# EasyEDA Pro project New Project_2025-03-25_15-12-27.eprj, board PCB1
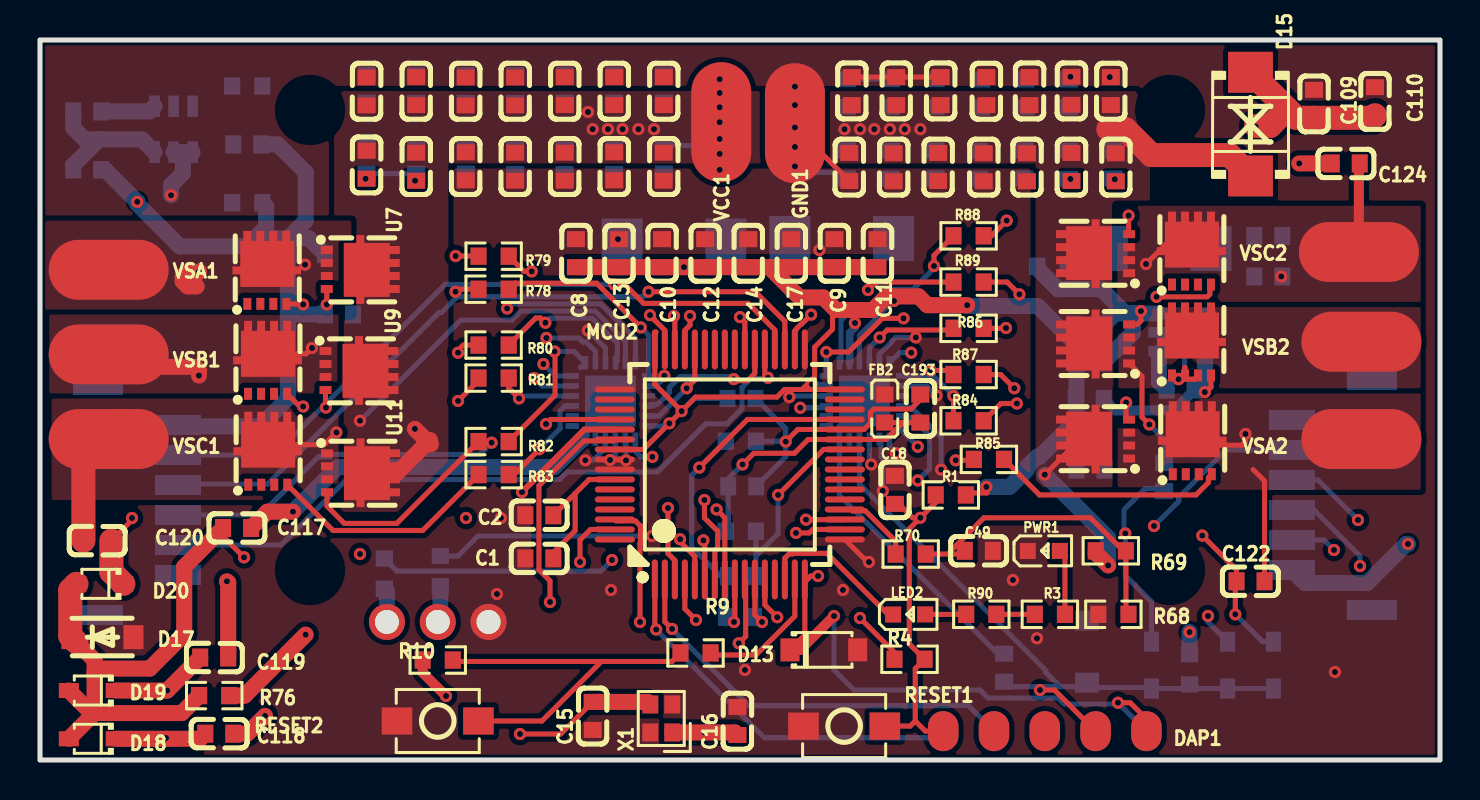
[diagram p4: board, top side]
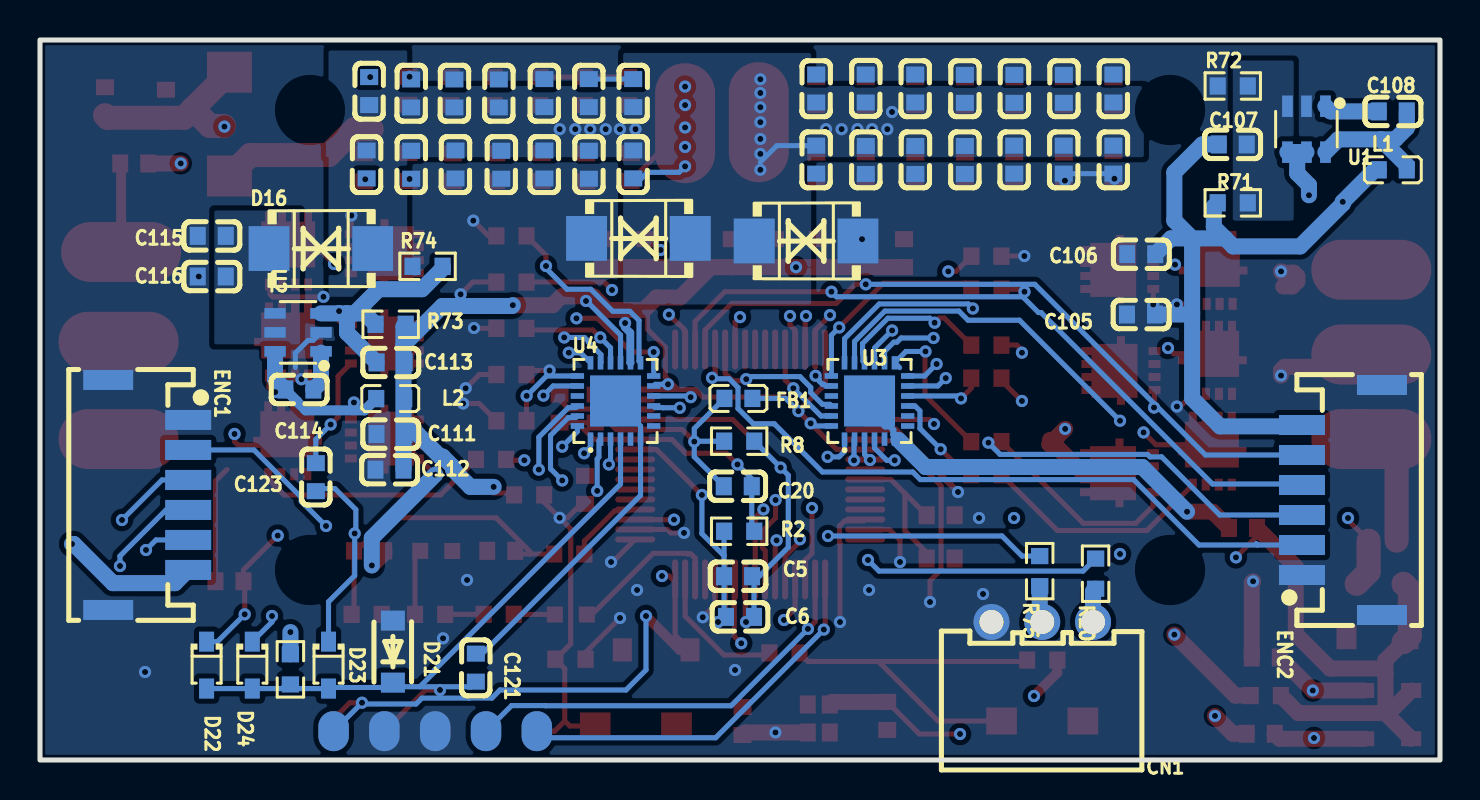
[diagram p5: board, bottom side, seen from below]

Outline 70 x 36 mm; copper layers: Top Layer, Inner1, Inner2, Inner3, Inner4, Bottom Layer. Coordinates in mm from the lower left corner of the outline.
Outline path: rectangle 0,36 70,0
Stack: Top Layer 0.035mm 外层铜厚1oz / Dielectric1 0.0994mm 3313 RC57% 4.2mil / Inner1 0.0152mm 内层铜厚 / Dielectric2 0.55mm 0.55mm H/H No copper / Inner2 0.0152mm 内层铜厚 / Dielectric3 0.1088mm 2116 RC54% 4.9mil / Inner3 0.0152mm 内层铜厚 / Dielectric4 0.55mm 0.55mm H/H No copper / Inner4 0.0152mm 内层铜厚 / Dielectric5 0.0994mm 3313 RC57% 4.2mil / Bottom Layer 0.035mm 外层铜厚1oz

## Design rules (mm)
template: 自定义配置
spacing copperThickness1oz (default): track to track 0.102, other pairs 0.152 to 0.3
spacing copperThickness2oz: track to track 0.203, other pairs 0.152 to 0.3
track width copperThickness1oz (default): min 0.127, default 0.254, max 2.54
track width copperThickness2oz: min 0.203, default 0.254, max 2.54
differential pair differentialPair (default): width min 0.127, default 0.254, max 2.54; gap min 0.152, default 0.152
via viaSize (default): diameter min 0.5, default 0.61, max 10; hole min 0.3, default 0.305, max 6.3

## Placement (name value [footprint] x y rotation side)
C1  4.7uF  [C0603]  24.97 10.08 0 top
C2  100nF  [C0603]  24.97 12.24 0 top
C5  2.5uf  [C0603]  35.1 9.19 180 bottom
C6  100nF  [C0603]  35 7.16 180 bottom
C8  4.7uF  [C0603]  26.8 25.34 90 top
C9  4.7uF  [C0603]  39.72 25.34 90 top
C10  100nF  [C0603]  31.1 25.34 90 top
C11  100nF  [C0603]  41.87 25.34 90 top
C12  4.7uF  [C0603]  33.26 25.34 90 top
C13  100nF  [C0603]  28.95 25.34 90 top
C14  4.7uF  [C0603]  35.41 25.34 90 top
C15  10pF  [C0603]  27.63 2.2 90 top
C16  10pF  [C0603]  34.87 1.95 90 top
C17  100nF  [C0603]  37.57 25.34 90 top
C18  100nF  [C0603]  42.75 13.51 90 top
C19  22nF  [C0603]  21.28 33.43 270 top
C20  100nF  [C0603]  35.11 13.69 180 bottom
C49  100nF  [C0603]  46.94 10.46 0 top
C50  22nF  [C0603]  16.33 33.43 270 top
C51  22nF  [C0603]  23.76 33.43 270 top
C52  22nF  [C0603]  16.33 29.76 90 top
C53  22nF  [C0603]  21.29 29.68 90 top
C54  22nF  [C0603]  40.59 33.45 270 top
C55  22nF  [C0603]  28.71 29.68 90 top
C56  22nF  [C0603]  42.81 33.45 270 top
C57  22nF  [C0603]  45.03 33.45 270 top
C58  22nF  [C0603]  49.47 33.45 270 top
C59  22nF  [C0603]  40.47 29.65 90 top
C60  22nF  [C0603]  31.19 30.02 90 bottom
C61  22nF  [C0603]  21.29 30.02 90 bottom
C62  22nF  [C0603]  18.81 30.02 90 bottom
C63  22nF  [C0603]  16.33 30.02 90 bottom
C64  22nF  [C0603]  51.57 29.65 90 top
C65  22nF  [C0603]  44.91 29.65 90 top
C66  22nF  [C0603]  18.81 33.56 270 bottom
C67  22nF  [C0603]  21.28 33.56 270 bottom
C68  22nF  [C0603]  23.76 33.56 270 bottom
C69  22nF  [C0603]  28.71 33.57 270 bottom
C70  22nF  [C0603]  51.44 33.33 270 bottom
C71  22nF  [C0603]  47.06 33.33 270 bottom
C72  22nF  [C0603]  49.28 33.33 270 bottom
C73  22nF  [C0603]  40.34 29.78 90 bottom
C74  22nF  [C0603]  53.67 29.78 90 bottom
C75  22nF  [C0603]  44.78 29.78 90 bottom
C76  22nF  [C0603]  49.23 29.78 90 bottom
C77  22nF  [C0603]  18.81 33.45 90 top
C78  22nF  [C0603]  28.71 33.45 90 top
C79  22nF  [C0603]  26.24 33.45 90 top
C80  22nF  [C0603]  31.19 33.45 90 top
C81  22nF  [C0603]  18.81 29.67 270 top
C82  22nF  [C0603]  31.18 29.67 270 top
C83  22nF  [C0603]  26.23 29.67 270 top
C84  22nF  [C0603]  23.76 29.67 270 top
C85  22nF  [C0603]  47.32 33.45 90 top
C86  22nF  [C0603]  51.57 33.46 90 top
C87  22nF  [C0603]  53.54 33.45 90 top
C88  22nF  [C0603]  28.71 30 270 bottom
C89  22nF  [C0603]  26.23 30 270 bottom
C90  22nF  [C0603]  23.76 30 270 bottom
C91  22nF  [C0603]  53.79 29.64 270 top
C92  22nF  [C0603]  49.35 29.64 270 top
C93  22nF  [C0603]  47.19 29.64 270 top
C94  22nF  [C0603]  42.68 29.64 270 top
C95  22nF  [C0603]  16.33 33.57 90 bottom
C96  22nF  [C0603]  26.24 33.57 90 bottom
C97  22nF  [C0603]  31.19 33.57 90 bottom
C98  22nF  [C0603]  40.34 33.34 90 bottom
C99  22nF  [C0603]  42.56 33.34 90 bottom
C100  22nF  [C0603]  44.78 33.34 90 bottom
C101  22nF  [C0603]  53.54 33.45 90 bottom
C102  22nF  [C0603]  42.56 29.76 270 bottom
C103  22nF  [C0603]  46.94 29.76 270 bottom
C104  22nF  [C0603]  51.44 29.76 270 bottom
C105  22nF  [C0603]  14.95 22.28 0 bottom
C106  100nF  [C0603]  14.94 25.29 0 bottom
C107  220pF  [C0603]  10.36 30.78 180 bottom
C108  100nF  [C0603]  2.36 32.43 0 bottom
C109  22nF  [C0603]  63.7 32.81 90 top
C110  100nF  [C0603]  66.75 32.94 90 top
C111  22nF  [C0603]  52.47 16.3 0 bottom
C112  100nF  [C0603]  52.53 14.52 0 bottom
C113  220pF  [C0603]  52.47 19.88 0 bottom
C114  100nF  [C0603]  57.03 18.52 180 bottom
C115  22nF  [C0603]  61.42 26.21 0 bottom
C116  100nF  [C0603]  61.42 24.17 0 bottom
C117  22nF  [C0603]  9.85 11.6 0 top
C118  4.7uF  [C0603]  8.97 1.31 0 top
C119  4.7uF  [C0603]  8.71 5.12 180 top
C120  4.7uF  [C0603]  2.87 10.97 0 top
C121  22nF  [C0603]  48.21 4.62 90 bottom
C122  4.7uF  [C0603]  60.53 8.94 0 top
C123  4.7uF  [C0603]  56.21 14.14 270 bottom
C124  4.7uF  [C0603]  65.29 29.83 180 top
C193  4.7uF  [C0603]  44.02 17.57 270 top
CN1  XH-3AW  [CONN-TH_3P-P2.54_HCTL_XH-3AW]  19.89 6.9 0 bottom
D5  SMBJ12CA  [SMB_L4.6-W3.6-LS5.4-BI]  40.08 26.08 180 bottom
D13  SMF3.3A  [SOD-123_L2.8-W1.8-LS3.7-RD]  39.19 5.51 0 top
D14  SMBJ12CA  [SMB_L4.6-W3.6-LS5.4-BI]  31.7 25.95 180 bottom
D15  SMBJ12CA  [SMB_L4.6-W3.6-LS5.4-BI]  60.53 31.8 270 top
D16  SMBJ12CA  [SMB_L4.6-W3.6-LS5.4-BI]  55.96 25.57 180 bottom
D17  BZT52C15-7-F  [SOD-123F_L2.8-W1.8-LS3.7-RD]  3.12 6.14 0 top
D18  B5819WS-TP  [SOD-323_L1.8-W1.3-LS2.5-RD]  2.61 1.06 180 top
D19  B5819WS-TP  [SOD-323_L1.8-W1.3-LS2.5-RD]  2.61 3.47 180 top
D20  B5819WS-TP  [SOD-323_L1.8-W1.3-LS2.5-RD]  3 8.81 180 top
D21  BZT52C15-7-F  [SOD-123F_L2.8-W1.8-LS3.7-RD]  52.35 5.42 90 bottom
D22  B5819WS-TP  [SOD-323_L1.8-W1.3-LS2.5-RD]  61.67 4.74 270 bottom
D23  B5819WS-TP  [SOD-323_L1.8-W1.3-LS2.5-RD]  55.57 4.74 270 bottom
D24  B5819WS-TP  [SOD-323_L1.8-W1.3-LS2.5-RD]  59.38 4.74 270 bottom
DAP1  SWD  [2X5 2.54MM双层贴片焊盘]  50.24 1.44 270 top
ENC1  ZX-ZH1.5-6PWT  [CONN-SMD_6P-P1.50_ZX-ZH1.5-6PWT]  64.59 13.25 270 bottom
ENC2  ZX-ZH1.5-6PWT  [CONN-SMD_6P-P1.50_ZX-ZH1.5-6PWT]  4.9 13 90 bottom
FB1  BLM18PG121SN1D  [L0603]  35.08 18.08 0 bottom
FB2  BLM18PG121SN1D  [L0603]  42.24 17.57 270 top
GND1  -  [焊盘]  37.75 31.84 90 top
L1  4.7uH  [L0603]  2.36 29.51 0 bottom
L2  4.7uH  [L0603]  52.49 18.07 180 bottom
LED2  -  [LED_0603]  43.51 7.28 0 top
MCU2  CYT2BL3CAAQ0AZEGST  [LQFP-64_L10.0-W10.0-P0.50-LS12.0-BL]  34.49 14.78 0 top
PWR1  -  [LED_0603]  50.24 10.46 0 top
R1  10kΩ  [R0603]  45.54 13.25 180 top
R2  0Ω  [R0603]  35.04 11.44 0 bottom
R3  4.7K  [R0603]  50.49 7.28 0 top
R4  100Ω  [R0603]  43.48 5.04 0 top
R8  0Ω  [R0603]  35.04 15.94 180 bottom
R9  100R  [R0603]  32.78 5.35 0 top
R10  4.7K  [R0603]  19.89 5 180 top
R20  100RΩ  [R0603]  17.22 9.32 90 bottom
R68  1K  [R0603]  53.67 7.28 180 top
R69  10K  [R0603]  53.54 10.46 0 top
R70  100R  [R0603]  43.53 10.3 0 top
R71  73.2kΩ  [R0603]  10.36 27.86 0 bottom
R72  10kΩ  [R0603]  10.36 33.7 180 bottom
R73  45.3kΩ  [R0603]  52.47 21.78 180 bottom
R74  10kΩ  [R0603]  50.62 24.68 180 bottom
R75  100RΩ  [R0603]  20.01 9.44 90 bottom
R76  100RΩ  [R0603]  8.71 3.22 180 top
R77  100RΩ  [R0603]  57.48 4.53 270 bottom
R78  4.7Ω  [R0603]  22.68 23.54 180 top
R79  4.7Ω  [R0603]  22.68 25.19 180 top
R80  4.7Ω  [R0603]  22.68 20.75 180 top
R81  4.7Ω  [R0603]  22.68 19.09 180 top
R82  4.7Ω  [R0603]  22.68 15.92 180 top
R83  4.7Ω  [R0603]  22.68 14.27 180 top
R84  4.7Ω  [R0603]  46.43 16.96 0 top
R85  4.7Ω  [R0603]  47.45 15.03 0 top
R86  4.7Ω  [R0603]  46.43 21.58 0 top
R87  4.7Ω  [R0603]  46.43 19.27 0 top
R88  4.7Ω  [R0603]  46.43 26.21 0 top
R89  4.7Ω  [R0603]  46.43 23.9 0 top
R90  4.7K  [R0603]  47.06 7.28 180 top
RESET1  -  [Key_SMD_3x4x2]  40.21 1.7 180 top
RESET2  -  [Key_SMD_3x4x2]  19.89 1.95 180 top
U1  RY9121E  [SOT-23-6_L2.9-W1.6-P0.95-LS2.8-BL]  6.68 31.54 0 bottom
U2  RY9121E  [SOT-23-6_L2.9-W1.6-P0.95-LS2.8-BL]  57.1 21.38 90 bottom
U3  FD6288Q  [QFN-24_L4.0-W4.0-P0.50-BL-EP2.6]  28.52 17.95 180 bottom
U4  FD6288Q  [QFN-24_L4.0-W4.0-P0.50-BL-EP2.6]  41.22 17.95 180 bottom
U7  TPN2R703NL,L1Q(M  [TSON-8_L3.1-W3.1-P0.65-LS3.3-BL-EP]  16.01 24.53 270 top
U8  TPN2R703NL,L1Q(M  [TSON-8_L3.1-W3.1-P0.65-LS3.3-BL-EP]  11.34 24.48 0 top
U9  TPN2R703NL,L1Q(M  [TSON-8_L3.1-W3.1-P0.65-LS3.3-BL-EP]  15.95 19.48 270 top
U10  TPN2R703NL,L1Q(M  [TSON-8_L3.1-W3.1-P0.65-LS3.3-BL-EP]  11.38 19.98 0 top
U11  TPN2R703NL,L1Q(M  [TSON-8_L3.1-W3.1-P0.65-LS3.3-BL-EP]  16.03 14.36 270 top
U12  TPN2R703NL,L1Q(M  [TSON-8_L3.1-W3.1-P0.65-LS3.3-BL-EP]  11.39 15.44 0 top
U13  TPN2R703NL,L1Q(M  [TSON-8_L3.1-W3.1-P0.65-LS3.3-BL-EP]  52.78 16.05 90 top
U14  TPN2R703NL,L1Q(M  [TSON-8_L3.1-W3.1-P0.65-LS3.3-BL-EP]  57.61 15.96 0 top
U15  TPN2R703NL,L1Q(M  [TSON-8_L3.1-W3.1-P0.65-LS3.3-BL-EP]  52.78 20.8 90 top
U16  TPN2R703NL,L1Q(M  [TSON-8_L3.1-W3.1-P0.65-LS3.3-BL-EP]  57.57 20.9 0 top
U17  TPN2R703NL,L1Q(M  [TSON-8_L3.1-W3.1-P0.65-LS3.3-BL-EP]  52.78 25.32 90 top
U18  TPN2R703NL,L1Q(M  [TSON-8_L3.1-W3.1-P0.65-LS3.3-BL-EP]  57.57 25.44 0 top
VCC1  -  [焊盘]  34.06 31.89 90 top
VSA1  -  [焊盘]  3.43 24.51 0 top
VSA2  -  [焊盘]  66.07 16.05 0 top
VSB1  -  [焊盘]  3.43 20.28 0 top
VSB2  -  [焊盘]  66.07 20.91 0 top
VSC1  -  [焊盘]  3.43 16.05 0 top
VSC2  -  [焊盘]  65.94 25.4 0 top
X1  16MHz  [CRYSTAL-SMD_4P-L2.0-W1.6-BL]  31.06 2.08 90 top

## Footprints (pads in the part's own frame, mm; a bottom-side part is the same pattern mirrored in y, then rotated)
2X5 2.54MM双层贴片焊盘
  oval 2x1.524 smd: 1(0,-5.08) 3(0,-2.54) 5(0,0) 7(0,2.54) 9(0,5.08)
  oval 2x1.524 smd far side: 2(0,-5.08) 4(0,-2.54) 6(0,0) 8(0,2.54) 10(0,5.08)
C0603
  rect 0.8x0.9 smd: 1(-0.7,0) 2(0.7,0)
CONN-SMD_6P-P1.50_ZX-ZH1.5-6PWT
  rect 1x2.3 smd: 1(-3.75,2) 2(-2.25,2) 3(-0.75,2) 4(0.75,2) 5(2.25,2) 6(3.75,2)
  rect 1x2.5 smd: 7(5.75,-2) 8(-5.75,-2)
CONN-TH_3P-P2.54_HCTL_XH-3AW
  round 1.8 hole 1.199: 1(-2.54,0) 2(0.002,0) 3(2.54,0)
CRYSTAL-SMD_4P-L2.0-W1.6-BL
  rect 0.9x0.8 smd: 1(-0.7,-0.55) 2(0.7,-0.55) 3(0.7,0.55) 4(-0.7,0.55)
Key_SMD_3x4x2
  rect 1.53x1.36 smd: 1(-2.035,0) 2(2.035,0)
L0603
  rect 0.8x0.864 smd: 1(-0.7,0) 2(0.7,0)
LED_0603
  rect 0.8x0.8 smd: 1(-0.851,-0.01) 2(0.75,-0.005)
LQFP-64_L10.0-W10.0-P0.50-LS12.0-BL
  oval 0.3x2 smd: 1(-3.75,-5.75) 2(-3.25,-5.75) 3(-2.75,-5.75) 4(-2.25,-5.75) 5(-1.75,-5.75) 6(-1.25,-5.75) 7(-0.75,-5.75) 8(-0.25,-5.75) 9(0.25,-5.75) 10(0.75,-5.75) 11(1.25,-5.75) 12(1.75,-5.75) 13(2.25,-5.75) 14(2.75,-5.75) 15(3.25,-5.75) 16(3.75,-5.75) 33(3.75,5.75) 34(3.25,5.75) 35(2.75,5.75) 36(2.25,5.75) 37(1.75,5.75) 38(1.25,5.75) 39(0.75,5.75) 40(0.25,5.75) 41(-0.25,5.75) 42(-0.75,5.75) 43(-1.25,5.75) 44(-1.75,5.75) 45(-2.25,5.75) 46(-2.75,5.75) 47(-3.25,5.75) 48(-3.75,5.75)
  oval 2x0.3 smd: 17(5.75,-3.75) 18(5.75,-3.25) 19(5.75,-2.75) 20(5.75,-2.25) 21(5.75,-1.75) 22(5.75,-1.25) 23(5.75,-0.75) 24(5.75,-0.25) 25(5.75,0.25) 26(5.75,0.75) 27(5.75,1.25) 28(5.75,1.75) 29(5.75,2.25) 30(5.75,2.75) 31(5.75,3.25) 32(5.75,3.75) 49(-5.75,3.75) 50(-5.75,3.25) 51(-5.75,2.75) 52(-5.75,2.25) 53(-5.75,1.75) 54(-5.75,1.25) 55(-5.75,0.75) 56(-5.75,0.25) 57(-5.75,-0.25) 58(-5.75,-0.75) 59(-5.75,-1.25) 60(-5.75,-1.75) 61(-5.75,-2.25) 62(-5.75,-2.75) 63(-5.75,-3.25) 64(-5.75,-3.75)
QFN-24_L4.0-W4.0-P0.50-BL-EP2.6
  rect 0.28x0.665 smd: 1(-1.25,-1.907) 2(-0.75,-1.907) 3(-0.25,-1.907) 4(0.25,-1.907) 5(0.75,-1.907) 6(1.25,-1.907) 13(1.25,1.907) 14(0.75,1.907) 15(0.25,1.907) 16(-0.25,1.907) 17(-0.75,1.907) 18(-1.25,1.907)
  rect 0.665x0.28 smd: 7(1.907,-1.25) 8(1.907,-0.75) 9(1.907,-0.25) 10(1.907,0.25) 11(1.907,0.75) 12(1.907,1.25) 19(-1.907,1.25) 20(-1.907,0.75) 21(-1.907,0.25) 22(-1.907,-0.25) 23(-1.907,-0.75) 24(-1.907,-1.25)
  rect 2.55x2.55 smd: 25(0,0)
R0603
  rect 0.806x0.864 smd: 1(-0.753,0) 2(0.753,0)
SMB_L4.6-W3.6-LS5.4-BI
  rect 2.047x2.241 smd: 1(-2.591,0) 2(2.591,0)
SOD-123_L2.8-W1.8-LS3.7-RD
  rect 0.95x1.15 smd: 1(-1.692,0) 2(1.692,0)
SOD-123F_L2.8-W1.8-LS3.7-RD
  rect 1x1.2 smd: 1(-1.55,0) 2(1.55,0)
SOD-323_L1.8-W1.3-LS2.5-RD
  rect 1x0.75 smd: 1(-1.173,0) 2(1.173,0)
SOT-23-6_L2.9-W1.6-P0.95-LS2.8-BL
  rect 0.532x1.072 smd: 1(-0.95,-1.149) 2(0,-1.149) 3(0.95,-1.149) 4(0.95,1.149) 5(0,1.149) 6(-0.95,1.149)
TSON-8_L3.1-W3.1-P0.65-LS3.3-BL-EP
  rect 0.4x0.6 smd: 1(-0.975,-1.675) 2(-0.325,-1.675) 3(0.325,-1.675) 4(0.975,-1.675) 5(0.975,1.675) 6(0.325,1.675) 7(-0.325,1.675) 8(-0.975,1.675)
  rect 0.6x0.4 smd: 9(-1.42,0) 9(1.42,0)
  rect 2.7x2.3 smd: 9(0.02,0.325)
焊盘
  oval 6x3 smd: 1(0,0)

## Nets
As in the schematic.

Pads without a net: DAP1 3 5; MCU2 13 21 22 23 24 25 30 31 40 41 42 43 50 51 59 60 61 64; U3 5 7 8 21; U4 5 7 8 21

## Via types
v1: diameter 0.61, hole 0.305, Top Layer to Bottom Layer, 185 vias

## Routing (per net, layer and track width the routed paths; a pad name or vN(x,y) marks a point on that pad's centre or on a via; arc(x,y) is an arc through that point)
+3.3V: length 1.9
  Top Layer w0.254: R90.1 R3.1
+5V: length 135.6
  Inner2 w0.8: v1(4.86,27.91) 5.67,28.72 5.67,28.73 12.25,35.3 66.7,35.3 69.3,32.7 69.3,11.7 v1(68.4,10.8)
  Bottom Layer w0.8: 10.74,26.08 11.31,26.65 11.31,27.66 R71.2 ; 10.74,26.08 10.34,25.68 6.99,25.68 4.86,27.81 v1(4.86,27.91) 3.26,29.51 L1.2 ; 10.74,26.08 12.39,26.08 ; C107.1 11.89,30.78 13.28,29.38 13.28,26.97 12.39,26.08 ; 12.39,26.08 12.39,22.32 ; 12.39,26.08 13.45,26.08 C106.1 ; 12.39,22.32 12.44,22.28 C105.1 ; 12.39,22.32 12.39,18.08 11,16.68 6.97,16.68 ENC2.6 ; v1(68.4,10.8) 68.31,10.8 66.35,8.84 63.25,8.84 ENC1.6
GND: length 24.1
  Top Layer w0.254: U16.1 U16.2 57.25,19.61 57.23,19.63 ; GND1.1 37.75,31.67 C59.1 ; v1(56.93,19.04) 57.71,19.04 U16.3 ; C54.1 C56.1 C57.1 ; MCU2.17 41.37,9.9 v1(41.45,9.9)
  Inner1 w0.254: 57.4,35.3 57.8,34.9 57.9,34.9 ; 57.23,19.63 56.96,19.9 56.1,19.9
  Bottom Layer w0.254: v1(37.75,29.68) 38.05,29.38 39.64,29.38 39.94,29.08 C73.1 ; C63.1 C62.1 ; U2.2 56.35,20.98 56.6,20.98 57.23,20.34 57.23,19.63 ; C98.2 C99.2
  vias: v1(16.28,29.06) v1(18.75,28.97) v1(22.85,8.3) v1(23.05,12.1) v1(28.55,8.5) v1(28.9,26.04) v1(35.25,4.5) v1(37.75,33.67) v1(37.75,32.75) v1(37.75,31.63) v1(37.75,30.65) v1(38.97,25.5) v1(40.15,8.5) v1(48.65,9) v1(49.85,6.08) v1(51.52,34.16) v1(51.52,29.05) v1(53.49,34.15) v1(53.74,29.04) v1(62.06,24.17) v1(64.75,4.4)
VBAT: length 72.2
  Top Layer w0.254: v1(50.24,14.27) 52.04,16.07 U13.9
  Top Layer w0.8: 19.4,15.9 17.84,14.34 U11.9 ; 19.4,15.9 19.5,16 ; 19.4,15.9 v1(18.74,16.56) ; 19.4,15.9 19.51,15.79 19.54,15.79 ; R76.1 10.23,3.22 v1(13.28,6.27) ; v1(53.41,9.73) 52.79,10.35 R69.1
  Top Layer w1.2: 53.41,31.54 54.27,31.54 55.57,30.25 59.48,30.25 D15.2
  Inner1 w0.254: v1(29.92,31.54) 30.43,31.54
  Inner1 w0.8: v1(13.28,6.27) 18.74,11.73 18.74,16.19 ; v1(27.4,32.4) 22.5,27.5 22.5,17 21.69,16.19 18.74,16.19 ; 18.74,16.19 v1(18.74,16.56) ; v1(53.41,9.73) 53.41,9.69 55.65,7.45 55.69,7.45 56.74,6.39 v1(57.48,6.39)
  Bottom Layer w0.254: 33.98,29.89 33.16,30.72 C60.2
  Bottom Layer w0.8: v1(50.24,14.27) 53.41,11.1 v1(53.41,9.73) ; v1(57.48,6.39) R77.1
  vias: v1(27.63,31.54) v1(28.4,31.54) v1(29.13,31.54) v1(30.7,31.54) v1(33.98,34.04) v1(33.98,33.35) v1(33.98,32.64) v1(33.98,31.89) v1(33.98,31.05) v1(33.98,30.31) v1(33.98,29.51) v1(40.22,31.54) v1(41,31.54) v1(41.71,31.54) v1(42.49,31.54) v1(43.24,31.54) v1(44.02,31.54)
VCC1V1: length 7.5
  Top Layer w0.254: MCU2.58 27.46,14.03 26.76,13.33 ; C1.2 25.67,10.38 26.76,11.47 26.76,13.33 ; 26.76,13.33 C2.2
VCC3V3: length 139.6
  Top Layer w0.254: 39.63,22.67 39.63,21.54 38.73,20.64 38.73,19.16 38.1,18.53 ; 30.8,21.4 30.74,21.34 MCU2.48 30.74,18.78 v1(32.08,17.44) ; v1(32.08,17.44) 30.16,15.53 MCU2.55 ; v1(32.08,17.44) 32.78,18.15 36.85,18.15 37.23,18.53 38.1,18.53 ; R1.1 46.39,13.35 47.34,13.35 47.32,13.38 v1(47.32,13.66) ; 38.1,18.53 MCU2.32 ; v1(38.9,9.2) 38.54,9.2 38.37,9.03 MCU2.16 38.24,6.25 D13.1
  Top Layer w0.5: R10.2 19.13,4.37 v1(20.3,3.2) ; v1(39.7,7.2) 38.01,5.51 D13.1
  Top Layer w0.8: v1(46.36,22.74) 44.37,22.74 43.93,23.18 42.32,23.18 41.64,22.5 39.8,22.5 39.17,23.13 37.98,23.13 36.47,24.64 ; 36.47,24.64 C17.1 C9.1 C11.1 ; 36.47,24.64 C14.1 C12.1 v1(32.2,24.64) C10.1 C13.1 C8.1
  Inner1 w0.254: v1(47.32,13.66) 47.32,13.33 46.69,12.69 42.69,12.69 39.2,9.2 v1(38.9,9.2)
  Inner2 w0.5: v1(39.7,7.2) 33.05,0.55 22.95,0.55 v1(20.3,3.2)
  Bottom Layer w0.254: C111.1 50.84,16.3 48.2,13.66 ; DAP1.10 53.96,2.8 51.2,2.8 50.91,3.09 48.53,3.09 48.52,3.1 47.4,3.1 47,3.5 40.7,3.5 39.7,4.5 v1(39.7,7.2) ; FB1.1 32.71,18.08 v1(32.08,17.44)
  Bottom Layer w0.8: 51.83,20.76 49.88,22.7 46.4,22.7 v1(46.36,22.74) ; 51.83,20.76 51.83,21.68 R73.2 ; 51.83,20.76 51.83,17 ; C112.1 51.83,17 ; 51.83,17 51.12,16.3 50,15.17 49.87,15.17 49.34,14.64 49.34,14.51 48.48,13.66 v1(47.32,13.66)
VDDA: length 15.3
  Top Layer w0.254: v1(37.29,15.92) 37.89,16.53 MCU2.28 41.2,16.53 41.52,16.85 41.52,17.38 41.69,17.55 43.55,17.55 44.02,18.02 C193.1
  Bottom Layer w0.254: 37.29,15.94 37.29,16.57 FB1.2 ; 37.29,15.94 v1(37.29,15.92) 37.29,15.16 C20.1 ; 37.29,15.94 R8.1
VSSA: length 14.3
  Top Layer w0.254: C193.2 43.14,16.87 ; 43.14,16.87 FB2.2 ; 43.14,16.87 42.3,16.03 MCU2.27 38.41,16.03 37.72,15.34 35.69,15.34 v1(35.13,14.78)
  Bottom Layer w0.254: R2.1 34.41,11.56 C20.2 34.41,14.06 v1(35.13,14.78)
BATADC: length 3.8
  Top Layer w0.254: R70.1 42.78,10.94 41.27,12.46 40.62,12.46 40.55,12.53 MCU2.20
DBG_RX: length 19.3
  Top Layer w0.254: v1(30.81,6.52) 30.74,6.59 MCU2.1
  Bottom Layer w0.254: DAP1.2 44.83,1.11 36.22,1.11 v1(30.81,6.52)
DBG_TX: length 20.8
  Top Layer w0.254: MCU2.2 31.24,6.92 v1(31.6,6.55)
  Bottom Layer w0.254: DAP1.4 46.42,2.72 44.73,2.72 44.72,2.71 35.44,2.71 v1(31.6,6.55)
ECO_IN: length 26.8
  Top Layer w0.254: MCU2.52 25.53,17.03 v1(25.3,16.8) ; v1(24,1.3) 26.03,1.3 C15.2
  Top Layer w0.8: X1.3 30.39,2.9 C15.2
  Inner2 w0.254: v1(24,1.3) 24,15.5 v1(25.3,16.8)
ECO_OUT: length 25.1
  Top Layer w0.3: v1(24.1,13.4) 27.23,16.53 MCU2.53
  Top Layer w0.8: C16.1 34.75,1.38 v1(33.23,1.38) X1.1
  Inner1 w0.3: v1(33.23,1.38) 24.1,10.5 v1(24.1,13.4)
ENC1_CS: length 31.5
  Top Layer w0.254: MCU2.12 36.24,7.76 v1(36.86,7.14)
  Inner1 w0.254: v1(55.7,11.7) 55.53,11.53 42.13,11.53 37.74,7.14 v1(36.86,7.14)
  Bottom Layer w0.254: v1(55.7,11.7) 56.76,12.76 56.77,12.76 56.94,12.93 56.94,13.14 59.3,15.5 ENC1.2
ENC1_MISO: length 42.2
  Top Layer w0.254: MCU2.9 34.74,6.94 v1(34.7,6.9)
  Inner1 w0.254: v1(34.7,6.9) 37,4.6 59.7,4.6 65.9,10.8 v1(65.9,12)
  Bottom Layer w0.254: ENC1.3 63.9,14 v1(65.9,12)
ENC1_MOSI: length 42.2
  Top Layer w0.254: v1(34.94,5.84) 35.28,6.18 35.28,8.99 MCU2.10
  Inner1 w0.254: v1(66,9.7) 65.3,9.7 59.85,4.24 36.85,4.24 35.26,5.84 v1(34.94,5.84)
  Bottom Layer w0.254: v1(66,9.7) 66,10.2 63.7,12.5 ENC1.4
ENC1_SCLK: length 36.1
  Top Layer w0.254: v1(36.1,6.9) 35.74,7.26 MCU2.11
  Inner1 w0.254: v1(36.1,6.9) 36.27,6.9 37.97,5.2 59.4,5.2 v1(64.7,10.5)
  Bottom Layer w0.254: ENC1.5 64.2,11 v1(64.7,10.5)
ENC2_CS: length 35.2
  Top Layer w0.254: MCU2.37 36.24,19.27 v1(36.4,19.11)
  Bottom Layer w0.254: 9.11,10.75 12.05,10.75 15.32,14.02 25.98,14.02 26.36,14.4 30.87,14.4 33.28,16.81 34.34,16.81 35.1,17.57 35.1,18.63 35.53,19.06 36.35,19.06 v1(36.4,19.11) ; 9.11,10.75 9.19,10.82 ; 9.11,10.75 ENC2.2
ENC2_MISO: length 38.1
  Top Layer w0.254: v1(38.56,22.27) 38.09,21.81 38.06,21.81 37.81,21.55 37.81,21.53 37.74,21.46 MCU2.34
  Inner2 w0.254: v1(22.58,15.87) 24.19,17.48 24.19,17.5 25.3,18.6 25.3,18.98 26.3,19.98 34.87,19.98 37.16,22.27 v1(38.56,22.27)
  Bottom Layer w0.254: v1(22.58,15.87) 21.99,15.28 14.62,15.28 14.5,15.16 13.92,15.16 11.01,12.25 ENC2.3
ENC2_MOSI: length 36.4
  Top Layer w0.254: v1(30.43,23.41) 35.76,23.41 37.24,21.93 MCU2.35
  Bottom Layer w0.254: ENC2.4 6.95,13.8 11.37,13.8 19.95,22.37 20.07,22.37 20.86,23.16 30.17,23.16 v1(30.43,23.41)
ENC2_SCLK: length 35.3
  Top Layer w0.254: v1(28.71,23.78) 29.23,23.78 30.19,22.83 35.41,22.83 36.74,21.5 MCU2.36
  Bottom Layer w0.254: v1(28.71,23.78) 20.26,23.78 11.72,15.25 ENC2.5
HOA1: length 10.2
  Top Layer w0.254: R78.1 23.73,23.84 27.83,23.84 30.04,21.63 v1(30.04,21.63)
  Bottom Layer w0.254: U3.19 30.43,21.24 v1(30.04,21.63)
HOA2: length 4.2
  Top Layer w0.254: v1(45.67,18.21) 45.68,18.2 R84.1
  Bottom Layer w0.254: U4.19 44.67,19.2 v1(45.67,18.21)
HOB1: length 7.7
  Top Layer w0.254: v1(25.27,21.86) 25.03,22.1 24.79,22.1 R80.1
  Bottom Layer w0.254: U3.16 28.85,19.94 28.85,20.31 28.87,20.33 28.87,20.82 27.61,22.09 25.5,22.09 v1(25.27,21.86)
HOB2: length 5.4
  Top Layer w0.254: R86.1 45.59,21.5 42.36,21.5 v1(41.99,21.13)
  Bottom Layer w0.254: U4.16 41.47,20.61 v1(41.99,21.13)
HOC1: length 7.6
  Top Layer w0.254: v1(25.73,20.43) 25.75,20.4 25.75,18.24 R82.1
  Bottom Layer w0.254: v1(25.73,20.43) 26.71,20.43 U3.13 27.26,19.86 27.02,19.62
HOC2: length 9.9
  Top Layer w0.254: R88.1 44.7,25.23 v1(44.7,24.7)
  Bottom Layer w0.254: v1(44.7,24.7) 44.7,24.59 43.65,23.54 42.46,23.54 41.35,22.43 40.5,22.43 40.05,21.98 40.05,19.94 U4.13
KEY: length 6.9
  Top Layer w0.254: MCU2.15 37.74,7.19 35.8,5.25 33.63,5.25 R9.2
LED: length 7.8
  Top Layer w0.254: MCU2.14 37.24,10.1 37.45,10.31 37.64,10.31 37.67,10.33 39.35,10.33 42.4,7.27 LED2.1
LOA1: length 8.9
  Top Layer w0.254: v1(24.59,24.43) 24.2,24.43 R79.1
  Inner1 w0.254: v1(24.71,19.09) 24.59,19.22 v1(24.59,24.43)
  Bottom Layer w0.254: v1(24.71,19.09) 25.11,18.7 U3.11
LOA2: length 19.3
  Top Layer w0.254: v1(45.78,14.99) 46.65,14.99 R85.1
  Inner1 w0.254: 38.7,18.7 42.07,18.7 v1(45.78,14.99)
  Inner2 w0.254: v1(45.78,14.99) 45.78,15.42 42.41,18.79 v1(38.6,18.79)
  Bottom Layer w0.254: U4.11 39.23,18.78 38.87,18.78 38.86,18.79 v1(38.6,18.79)
LOB1: length 3.9
  Top Layer w0.254: R81.1 23.43,18.6 v1(23.95,18.08)
  Bottom Layer w0.254: v1(23.95,18.08) 24.07,18.2 U3.10
LOB2: length 10.8
  Top Layer w0.254: v1(44.53,19.48) 45.47,19.48 R87.1
  Inner1 w0.254: v1(44.53,19.48) 44.43,19.38 38.5,19.38 37.47,18.34 v1(37.47,18.14)
  Bottom Layer w0.254: U4.10 37.53,18.2 v1(37.47,18.14)
LOC1: length 5.1
  Top Layer w0.254: R83.1 23.7,14.27 v1(24.97,15.54)
  Bottom Layer w0.254: U3.9 26.25,17.7 26,17.46 26,16.58 v1(24.97,15.54)
LOC2: length 13.1
  Top Layer w0.254: v1(41.4,23.5) 41.8,23.9 R89.1
  Inner2 w0.254: v1(38.01,17.61) 38.01,17.86 38.05,17.9 38.05,18.39 38.01,18.42 38.01,20.11 v1(41.4,23.5)
  Bottom Layer w0.254: U4.9 39.23,17.62 38.87,17.62 38.86,17.61 v1(38.01,17.61)
PWM1AH: length 7.5
  Top Layer w0.254: v1(34.69,19.04) 34.76,18.97 35.38,18.97 35.74,19.33 MCU2.38
  Bottom Layer w0.254: U3.22 30.51,17.78 30.88,17.78 31.46,18.37 31.46,18.63 32,19.17 34.56,19.17 v1(34.69,19.04)
PWM1AL: length 12.1
  Top Layer w0.254: MCU2.39 35.24,21.9 v1(35,22.14)
  Inner1 w0.254: v1(35,22.14) 35,20.11 34.51,19.63 34.45,19.63 34.11,19.28 34.11,18.64 v1(30.62,15.16)
  Bottom Layer w0.254: v1(30.62,15.16) 30.05,15.16 29.77,15.43 U3.1
PWM1BH: length 4.6
  Top Layer w0.254: v1(32.33,18.59) 32.74,19 MCU2.44
  Bottom Layer w0.254: U3.23 30.95,17.2 v1(32.33,18.59)
PWM1BL: length 12.8
  Top Layer w0.254: MCU2.45 32.24,21.48 32.5,21.74 v1(32.5,22.2)
  Inner1 w0.254: v1(29.3,14.98) 29.3,20.06 31.12,21.88 31.12,22.44 31.46,22.78 31.94,22.78 32.28,22.44 32.28,22.42 v1(32.5,22.2)
  Bottom Layer w0.254: v1(29.3,14.98) 29.3,16.02 U3.2
PWM1CH: length 8.2
  Top Layer w0.254: v1(31.7,22.2) 31.74,22.16 MCU2.46
  Inner1 w0.254: v1(31.47,16.83) 31.5,16.86 31.5,17.69 31.7,17.89 v1(31.7,22.2)
  Bottom Layer w0.254: v1(31.47,16.83) 31.34,16.7 U3.24
PWM1CL: length 11.7
  Top Layer w0.254: MCU2.47 31.24,21.48 30.73,22 30.73,22.02 v1(30.5,22.25)
  Inner1 w0.254: v1(28.5,15) 28.5,21 29.75,22.25 v1(30.5,22.25)
  Bottom Layer w0.254: v1(28.5,15) 28.72,15.22 28.72,15.23 28.77,15.28 U3.3
PWM2AH: length 23.2
  Top Layer w0.254: MCU2.3 31.74,9.98 31.4,10.33 v1(31.4,12.6)
  Inner2 w0.254: v1(31.4,12.6) 32.73,12.6 33.59,11.74 37.17,11.74 38.03,12.6 40.46,12.6 42.56,14.7 44.88,14.7 v1(45.06,14.52)
  Bottom Layer w0.254: U4.22 43.21,17.62 43.58,17.62 45.06,16.14 v1(45.06,14.52)
PWM2AL: length 17.4
  Top Layer w0.254: MCU2.4 32.24,7.56 v1(32.8,7)
  Inner1 w0.254: v1(32.8,7) 35.64,9.84 37.12,9.84 38.88,11.61 38.88,13.08 41.14,15.34 v1(42.79,15.34)
  Bottom Layer w0.254: U4.1 42.47,15.66 v1(42.79,15.34)
PWM2BH: length 20.2
  Top Layer w0.254: MCU2.5 32.74,10.18 32,10.92 v1(32,11.04)
  Inner2 w0.254: v1(43.89,13.98) 40.31,10.4 32.93,10.4 32.29,11.04 v1(32,11.04)
  Bottom Layer w0.254: v1(43.89,13.98) 44.47,14.56 44.47,16.23 43.58,17.12 43.21,17.12 U4.23
PWM2BL: length 14.6
  Top Layer w0.254: v1(33.17,10.98) 33.24,10.91 MCU2.6
  Inner2 w0.254: v1(42.14,13.46) 39.67,10.98 v1(33.17,10.98)
  Bottom Layer w0.254: U4.2 42.05,15.96 42.05,15.15 42.14,15.06 v1(42.14,13.46)
PWM2CH: length 18.6
  Top Layer w0.254: v1(33.22,13) 33.22,12.11 33.88,11.45 33.88,10.61 33.74,10.47 MCU2.7
  Inner1 w0.254: v1(33.22,13) 33.22,13.89 35.25,15.92 36.46,15.92 37.04,15.34 37.53,15.34 38.11,15.92 43.64,15.92 v1(43.89,15.67)
  Bottom Layer w0.254: U4.24 43.13,16.43 v1(43.89,15.67)
PWM2CL: length 13.6
  Top Layer w0.254: v1(33.83,12.53) 34.24,12.11 MCU2.8
  Inner2 w0.254: v1(41.56,14.78) 39.7,14.78 37.45,12.53 v1(33.83,12.53)
  Bottom Layer w0.254: v1(41.56,14.78) 41.47,14.86 U4.3
RST: length 17.2
  Top Layer w0.254: DAP1.1 44.27,1.44 43.76,1.95 ; R1.2 44.79,12.88 v1(44.02,12.11) ; C18.1 42.94,12.81 43.64,12.11 v1(44.02,12.11) ; 43.76,1.95 43.76,4.57 R4.2 43.46,5.8 43.46,11.56 v1(44.02,12.11) ; 43.76,1.95 43.51,1.7 RESET1.1
SWCLK: length 31.9
  Top Layer w0.254: v1(50,3.5) 50.72,3.5 DAP1.7 ; MCU2.62 28.81,11.96 29.77,11.96 30.02,11.7 30.02,10.85 30,10.83 v1(30,6.9)
  Inner1 w0.254: v1(30,6.9) 30,5.9 32.4,3.5 v1(50,3.5)
SWDIO: length 36.3
  Top Layer w0.254: v1(53.9,2.86) 54.51,2.86 55.5,1.88 55.5,1.62 DAP1.9 ; MCU2.63 27.53,11.53 27,11 v1(27,9.9)
  Inner1 w0.254: v1(53.9,2.86) 32.44,2.86 27,8.3 v1(27,9.9)
UART_RX: length 24.1
  Top Layer w0.254: MCU2.18 38.64,11.53 38.46,11.35 v1(37.8,11.35)
  Inner1 w0.254: v1(37.8,11.35) 36.65,10.2 28.8,10.2 v1(28.6,10)
  Bottom Layer w0.254: R20.2 17.84,9.45 28.05,9.45 v1(28.6,10)
UART_TX: length 21
  Top Layer w0.254: v1(38.3,12.02) 40.23,12.02 MCU2.19
  Inner1 w0.254: v1(30.6,11.2) 31.42,12.02 33.51,12.02 33.59,11.94 34.07,11.94 34.14,12.02 v1(38.3,12.02)
  Bottom Layer w0.254: R75.2 20.9,10.2 21.9,11.2 v1(30.6,11.2)
VBA1: length 39.5
  Top Layer w0.254: v1(6.3,1.1) 6.34,1.06
  Top Layer w0.8: D18.1 8.01,1.06 C118.1
  Inner2 w0.254: v1(6.3,1.1) 9.1,1.1 19.1,11.1 21.13,11.1 23,12.97 23,15.33 26.89,19.21 v1(31.22,19.21)
  Bottom Layer w0.254: U3.20 30.71,18.7 30.79,18.78 30.88,18.78 31.04,18.95 31.04,19.03 v1(31.22,19.21)
VBA2: length 25.2
  Top Layer w0.254: v1(58.11,11.22) 59.83,9.51 C122.1 59.76,8.87 v1(59.76,7.28)
  Inner1 w0.254: v1(58.11,11.22) 56.59,12.75 50.3,12.75 v1(44.83,18.22)
  Bottom Layer w0.254: U4.20 44.35,18.7 v1(44.83,18.22) ; v1(59.76,7.28) 61.13,5.92 D22.1
VBB1: length 42.1
  Top Layer w0.8: C119.2 v1(6.36,3.47) D19.1
  Inner1 w0.254: v1(16,16.96) v1(16,10.3)
  Inner2 w0.254: v1(6.36,3.47) 9.66,3.47 13.91,7.72 14.82,7.72 16,8.9 v1(16,10.3)
  Bottom Layer w0.254: v1(16,16.96) 21.03,21.99 23.6,21.99 24.06,22.45 27.75,22.45 29.27,20.93 U3.17
VBB2: length 26.8
  Inner2 w0.254: v1(54.27,11.33) 44.47,21.13 v1(43.79,21.13)
  Bottom Layer w0.254: C123.2 56.08,13.57 55.25,13.57 54.21,12.52 54.21,11.39 v1(54.27,11.33) 54.27,9.22 55.57,7.91 D23.1 ; v1(43.79,21.13) 42.77,21.13 42.57,20.92 42.57,20.89 41.95,20.27 41.95,19.88 U4.17
VBC1: length 31.8
  Top Layer w0.254: v1(4.6,12.1) 4.6,12 C120.2
  Top Layer w1.2: C120.2 3.57,9.41 D20.1
  Inner2 w0.254: v1(4.6,12.1) 4.6,12.2 11.8,19.4 23.62,19.4 v1(25.32,21.1)
  Bottom Layer w0.254: U3.14 27.77,20.43 27.31,20.89 27.15,20.89 26.94,21.1 v1(25.32,21.1)
VBC2: length 55.3
  Top Layer w0.8: v1(62.96,29.83) C124.2
  Inner1 w0.39: v1(62.96,29.83) 62.79,30 48.9,30 v1(40.75,21.85)
  Inner2 w0.254: v1(40.75,21.85) 41.4,21.19 41.4,20.89 44.25,18.04 44.25,17.55 54.6,7.2 v1(58.4,7.2)
  Bottom Layer w0.254: D24.1 58.4,6.9 v1(58.4,7.2)
  Bottom Layer w0.39: U4.14 40.49,19.87 40.49,21.36 40.75,21.62 v1(40.75,21.85)
VREFH: length 18.8
  Top Layer w0.254: v1(32.97,14.62) 35.37,17.03 MCU2.29
  Bottom Layer w0.254: R8.2 v1(32.97,14.62) 32.59,14.24 32.59,10.64 34.03,9.19 C5.2 34.3,9.09 C6.2
VREFL: length 12.1
  Top Layer w0.254: v1(36.91,13.25) 39.18,15.53 MCU2.26
  Bottom Layer w0.254: C6.1 35.8,7.25 C5.1 35.8,10.21 ; R2.2 35.8,11.44 35.8,10.21 ; v1(36.91,13.25) 36.91,11.32 35.8,10.21
VSA1: length 50.6
  Top Layer w0.8: v1(7.95,24.43) 7.89,24.37 7.31,24.37 7.13,24.19 7.13,23.93 7.39,23.68 7.83,23.68 ; v1(11.25,2.2) 10.36,1.31 C118.2
  Inner1 w0.8: v1(7.95,24.43) 11.29,21.09 11.29,2.24 v1(11.25,2.2)
  Inner2 w0.254: v1(23.36,22.58) 18.66,22.58 18.28,22.19 12.91,22.19 12.91,22.2 12.4,22.2 12,22.6 12,24 12.77,24.77 v1(13.25,24.77)
  Bottom Layer w0.254: v1(23.36,22.58) 23.59,22.8 28.04,22.8 29.77,21.07 U3.18
VSA2: length 29.7
  Top Layer w0.254: 61.23,8.94 61.23,13.95 60.65,14.52 ; U14.9 58.18,15.74 60.09,15.74 60.27,15.92 v1(60.27,16.3)
  Inner1 w0.254: v1(60.27,16.3) 60.27,17.19 58.65,18.82 57.78,18.82 57.42,18.46 55.3,18.46 54.94,18.82 51.03,18.82 49.48,20.36 v1(43.56,20.36)
  Bottom Layer w0.254: U4.18 42.98,20.36 v1(43.56,20.36)
VSB1: length 39.1
  Top Layer w0.254: U10.9 13.31,20.31 v1(13.6,20.6)
  Top Layer w0.8: v1(9.35,8.94) 9.41,8.87 C119.1 ; VSB1.1 4.06,19.66 7.77,19.66 7.95,19.48 v1(7.95,19.22)
  Inner1 w0.8: v1(9.35,8.94) 9.35,17.83 v1(7.95,19.22)
  Inner2 w0.254: v1(27.39,21.48) 26.7,21.48 25.73,22.45 25.03,22.45 24.06,21.48 14.38,21.48 13.6,20.7 v1(13.6,20.6)
  Bottom Layer w0.254: U3.15 28.27,20.6 v1(27.39,21.48)
VSB2: length 25.2
  Top Layer w0.254: v1(55.47,16.78) 55.1,17.14 55.1,19.18 U15.1
  Inner2 w0.254: v1(55.47,16.78) 48.84,23.4 43.15,23.4 v1(42.7,22.95)
  Bottom Layer w0.254: v1(42.7,22.95) 42.68,22.95 40.97,21.25 U4.15 ; v1(55.47,16.78) 56.21,16.03 C123.1
VSC1: length 23.4
  Top Layer w0.254: v1(14.82,16.38) 14.21,15.77 U12.9
  Top Layer w1.2: C120.1 2.17,14.78 VSC1.1
  Top Layer w2: VSC1.1 3.94,16.56
  Inner2 w0.254: v1(25.17,19.8) 24.59,19.8 21.17,16.38 v1(14.82,16.38)
  Bottom Layer w0.254: U3.12 25.77,19.2 v1(25.17,19.8)
VSC2: length 26.4
  Top Layer w0.254: v1(55.3,24.8) 56.27,25.77 57.59,25.77 ; v1(39.32,20.4) 40.43,20.4 42.12,22.08 v1(43.18,22.08)
  Top Layer w0.5: VSC2.1 65.94,29.79 C124.1
  Inner1 w0.254: v1(55.3,24.8) 55,25.1 47.47,25.1 44.46,22.08 v1(43.18,22.08)
  Bottom Layer w0.254: U4.12 v1(39.32,20.4)
$1N1712: length 29.4
  Top Layer w0.254: v1(25.5,7.9) 25.5,8.96 24.95,9.51 24.95,13.71 27.19,15.96 28.67,15.96 MCU2.54 ; R4.1 42.72,5.38 v1(41,7.1)
  Inner2 w0.254: v1(41,7.1) 40.2,7.9 v1(25.5,7.9)
$1N1753: length 19
  Top Layer w0.254: RESET2.1 25.09,1.95 28.07,4.93 ; R9.1 31.6,4.93 28.07,4.93 ; 28.07,4.93 20.71,4.93 R10.1
$1N1759: length 15.5
  Top Layer w0.254: R70.2 45.51,10.3 ; 45.51,10.3 46.08,10.3 C49.1 ; 45.51,10.3 45.51,10.42 47.19,12.11 52.52,12.11 54.17,10.46 R69.2 54.3,7.41 R68.1
$1N3506: length 3.3
  Top Layer w0.254: R3.2 51.25,10.2 PWR1.2
$1N3509: length 2.1
  Top Layer w0.254: R90.2 46.31,7.28 LED2.2
$2N2924: length 2.8
  Bottom Layer w0.8: C108.2 5.47,32.43 U1.1
$2N2932: length 7.5
  Bottom Layer w0.8: U1.6 5.09,31.03 2.95,31.03 ; L1.1 1.66,29.74 2.95,31.03 ; C108.1 1.66,31.61 2.23,31.03 2.95,31.03
$2N3008: length 68.9
  Top Layer w1.2: 62.36,32.56 D15.1 ; 62.36,32.56 61.5,31.7 60.8,31.7 ; 62.36,32.56 62.8,32.11 C109.1 66.62,32.11 C110.1
  Inner2 w0.6: v1(60.78,31.67) 60.78,31.47 57.12,27.81 55.06,27.81 54.76,28.11 48.26,28.11 47.96,27.81 7,27.81 6.87,27.94 6.85,27.94 v1(6.55,28.24)
  Bottom Layer w0.8: 7.14,30.39 7.14,29.34 6.55,28.75 v1(6.55,28.24) ; 7.14,30.39 U1.4 ; 7.14,30.39 U1.5
$2N3496: length 7.1
  Bottom Layer w0.5: C114.1 57.13,17.92 57.13,17.91 56.71,17.48 53.77,17.48 L2.1
  Bottom Layer w0.8: C114.1 58.25,19.04 58.25,20.21
$2N3502: length 11.5
  Bottom Layer w0.8: C113.2 54.65,21.36 54.65,22.33 ; R73.1 53.77,22.33 54.27,22.33 ; 54.65,22.33 54.27,22.33 ; 54.65,22.33 U2.3 ; 54.27,22.33 53.06,23.54 50.9,23.54 49.86,24.58 49.86,24.67 R74.2
$2N3508: length 2
  Bottom Layer w0.8: 55.95,20.36 55.95,18.91 C114.2
$2N3712: length 1.8
  Bottom Layer w0.8: CN1.2 20.01,7.03 R75.1
$2N3716: length 1.7
  Bottom Layer w0.8: R20.1 17.35,8.44 CN1.1
$2N4660: length 20.9
  Top Layer w0.8: C117.2 11.37,12.42 v1(12.65,12.42)
  Bottom Layer w0.3: 27.2,16.13 27.33,16.26 27.33,16.5 27.51,16.68 27.75,16.68 28.52,17.45 U3.25
  Bottom Layer w0.8: 27.08,16.01 25.72,14.65 14.88,14.65 v1(12.65,12.42)
$2N5343: length 50.3
  Top Layer w0.254: v1(10.2,10.13) 9.15,11.18 C117.1
  Top Layer w0.8: 2.73,2.35 2.73,4.35 ; 2.73,2.35 7.08,2.35 R76.2 ; 2.73,2.35 2.57,2.35 D19.2 ; 2.73,2.35 D18.2 ; 2.73,4.35 2.95,4.57 5.49,4.57 7.21,6.29 7.21,9.66 C117.1 ; 2.73,4.35 2.73,4.99 1.82,5.89
  Top Layer w1.2: D20.2 1.51,8.5 1.51,6.2 1.82,5.89
  Inner1 w0.254: v1(21.3,12.1) 24.1,14.9 27.18,14.9 v1(27.27,14.98)
  Inner2 w0.254: v1(10.2,10.13) 11.54,10.13 13.51,12.1 v1(21.3,12.1)
  Bottom Layer w0.254: U3.4 28.27,15.6 27.66,14.98 v1(27.27,14.98)
$2N5939: length 16.8
  Bottom Layer w0.254: U4.25 39.97,16.7 U4.6 39.97,13.23 47.89,5.32 C121.2
$2N5985: length 30.6
  Bottom Layer w0.254: 51.01,3.66 52.15,3.66 D21.1 52.35,3.81 52.53,3.63 55.52,3.63 D23.2 57.27,3.57 R77.2 ; 51.01,3.66 48.46,3.66 C121.1 ; 51.01,3.66 50.29,4.38 50.29,4.48 40.97,13.8 U4.4 ; 57.48,3.99 57.9,3.57 D24.2 D22.2
$2N12019: length 8.7
  Top Layer w0.254: R78.2 20.9,23.54 v1(20.78,23.41) ; U7.4 v1(14.34,22.78)
  Inner1 w0.254: v1(14.34,22.78) 20.14,22.78 v1(20.78,23.41)
$2N12335: length 10.6
  Top Layer w0.254: R79.2 21.92,25.2 v1(20.78,25.2) ; U8.4 13.13,22.81 v1(13.16,22.78)
  Inner2 w0.254: v1(20.78,25.2) 18.36,22.78 v1(13.16,22.78)
$2N12658: length 9.9
  Top Layer w0.254: R80.2 21.16,20.75 20.9,20.49 v1(20.9,20.36) ; 14.28,18.5 14.28,17.59 14.3,17.57
  Inner1 w0.254: v1(20.9,20.36) 18.16,17.62 v1(14.3,17.62)
$2N12663: length 10.6
  Top Layer w0.254: U10.4 12.99,17.67 v1(13.16,17.67) ; R81.2 21.93,18.98 v1(20.9,17.95)
  Inner2 w0.254: v1(13.16,17.67) 13.26,17.57 20.52,17.57 v1(20.9,17.95)
$2N12936: length 10.3
  Top Layer w0.254: R82.2 17.84,11.83 15.21,11.83 14.35,12.69 U11.4
$2N12941: length 11.7
  Top Layer w0.254: R83.2 19.13,11.47 14.65,11.47 U12.4
$2N14524: length 8.4
  Top Layer w0.254: R84.2 48.05,17.83 v1(48.84,17.83) ; U13.4 54.3,17.17 v1(54.3,17.88)
  Inner1 w0.254: v1(54.3,17.88) 48.89,17.88 v1(48.84,17.83)
$2N14529: length 11.7
  Top Layer w0.254: R85.2 49.98,13.25 57.8,13.25 58.42,13.87 58.42,14.12 U14.4
$2N14559: length 9.4
  Top Layer w0.254: R86.2 48.28,21.58 v1(48.3,21.6) ; U15.4 54.46,21.78 54.87,21.78 55.05,21.96 v1(55.05,22.45)
  Inner1 w0.254: v1(48.3,21.6) 49.15,22.45 v1(55.05,22.45)
$2N14564: length 12.7
  Top Layer w0.254: U16.4 58.55,18.64 58.3,18.4 v1(58.24,18.4) ; R87.2 48.03,19.27 v1(48.72,18.59)
  Inner1 w0.254: v1(58.24,18.4) 57.95,18.1 54.91,18.1 54.55,18.46 48.84,18.46 v1(48.72,18.59)
$2N14594: length 8.8
  Top Layer w0.254: v1(54.43,27.22) 54.43,26.32 U17.4 ; v1(48.34,26.97) 47.57,26.21 R88.2
  Inner2 w0.254: v1(54.43,27.22) 54.18,27.48 48.84,27.48 v1(48.34,26.97)
$2N14599: length 12.2
  Top Layer w0.254: U18.4 58.49,23.71 58.49,23.29 58.36,23.16 55.83,23.16 v1(55.83,23.16) ; v1(48.97,23.29) 48.36,23.9 R89.2
  Inner1 w0.254: v1(48.97,23.29) 49.1,23.16 v1(55.83,23.16)

## Copper pours and planes (outline as drawn; the poured copper is in the pictures)
GND on Top Layer: -2.1,38.3 73.6,38.3 73.6,-5.9 -2.1,-5.9
GND on Bottom Layer: -5.2,39.9 73.7,39.9 73.7,-9.7 -5.2,-9.7
GND on Inner1: -3,37.5 73.2,37.5 73.2,-4.5 -3,-4.5
GND on Inner2: -5.5,40.1 78.2,40.1 78.2,-10.8 -5.5,-10.8
VBAT on Top Layer: 49.78,33.34 55.5,33.34 55.5,13.53 49.78,13.53
VBAT on Top Layer: 14.7,33.45 20.42,33.45 20.42,12.41 14.7,12.41
VBAT on Top Layer: 15.44,33.45 54.83,33.45 54.83,29.83 15.44,29.83
VBAT on Bottom Layer: 14.81,33.7 55.7,33.7 55.7,30.14 14.81,30.14
VBAT on Bottom Layer: 51.64,35.48 55.57,35.48 55.57,23.16 51.64,23.16
VBAT on Bottom Layer: 31.44,35.35 40.84,35.35 40.84,22.78 31.44,22.78
VBAT on Inner1: 26.75,35.86 44.8,35.86 44.8,27.17 26.75,27.17
VSA1 on Top Layer: 0.2,26.97 15.57,26.97 15.57,22.27 0.2,22.27
VSA2 on Top Layer: 53.88,18.59 69.04,18.59 69.04,13.51 53.88,13.51
VSB1 on Top Layer: 0.46,22.27 14.93,22.27 14.93,18.21 0.46,18.21
VSB2 on Top Layer: 53.92,22.89 69.04,22.89 69.04,18.59 53.92,18.59
VSC1 on Top Layer: 0.58,18.08 14.93,18.08 14.93,13 0.58,13
VSC2 on Top Layer: 53.85,27.71 69.04,27.71 69.04,22.91 53.85,22.91
$2N2714 on Bottom Layer: 7.31,34.97 10.36,34.97 10.36,26.97 7.31,26.97
$2N3480 on Bottom Layer: 57,27.48 61.29,27.48 61.29,20.78 57,20.78
